# EAGLE design PhoneRobot (EAGLE 6.5.0)
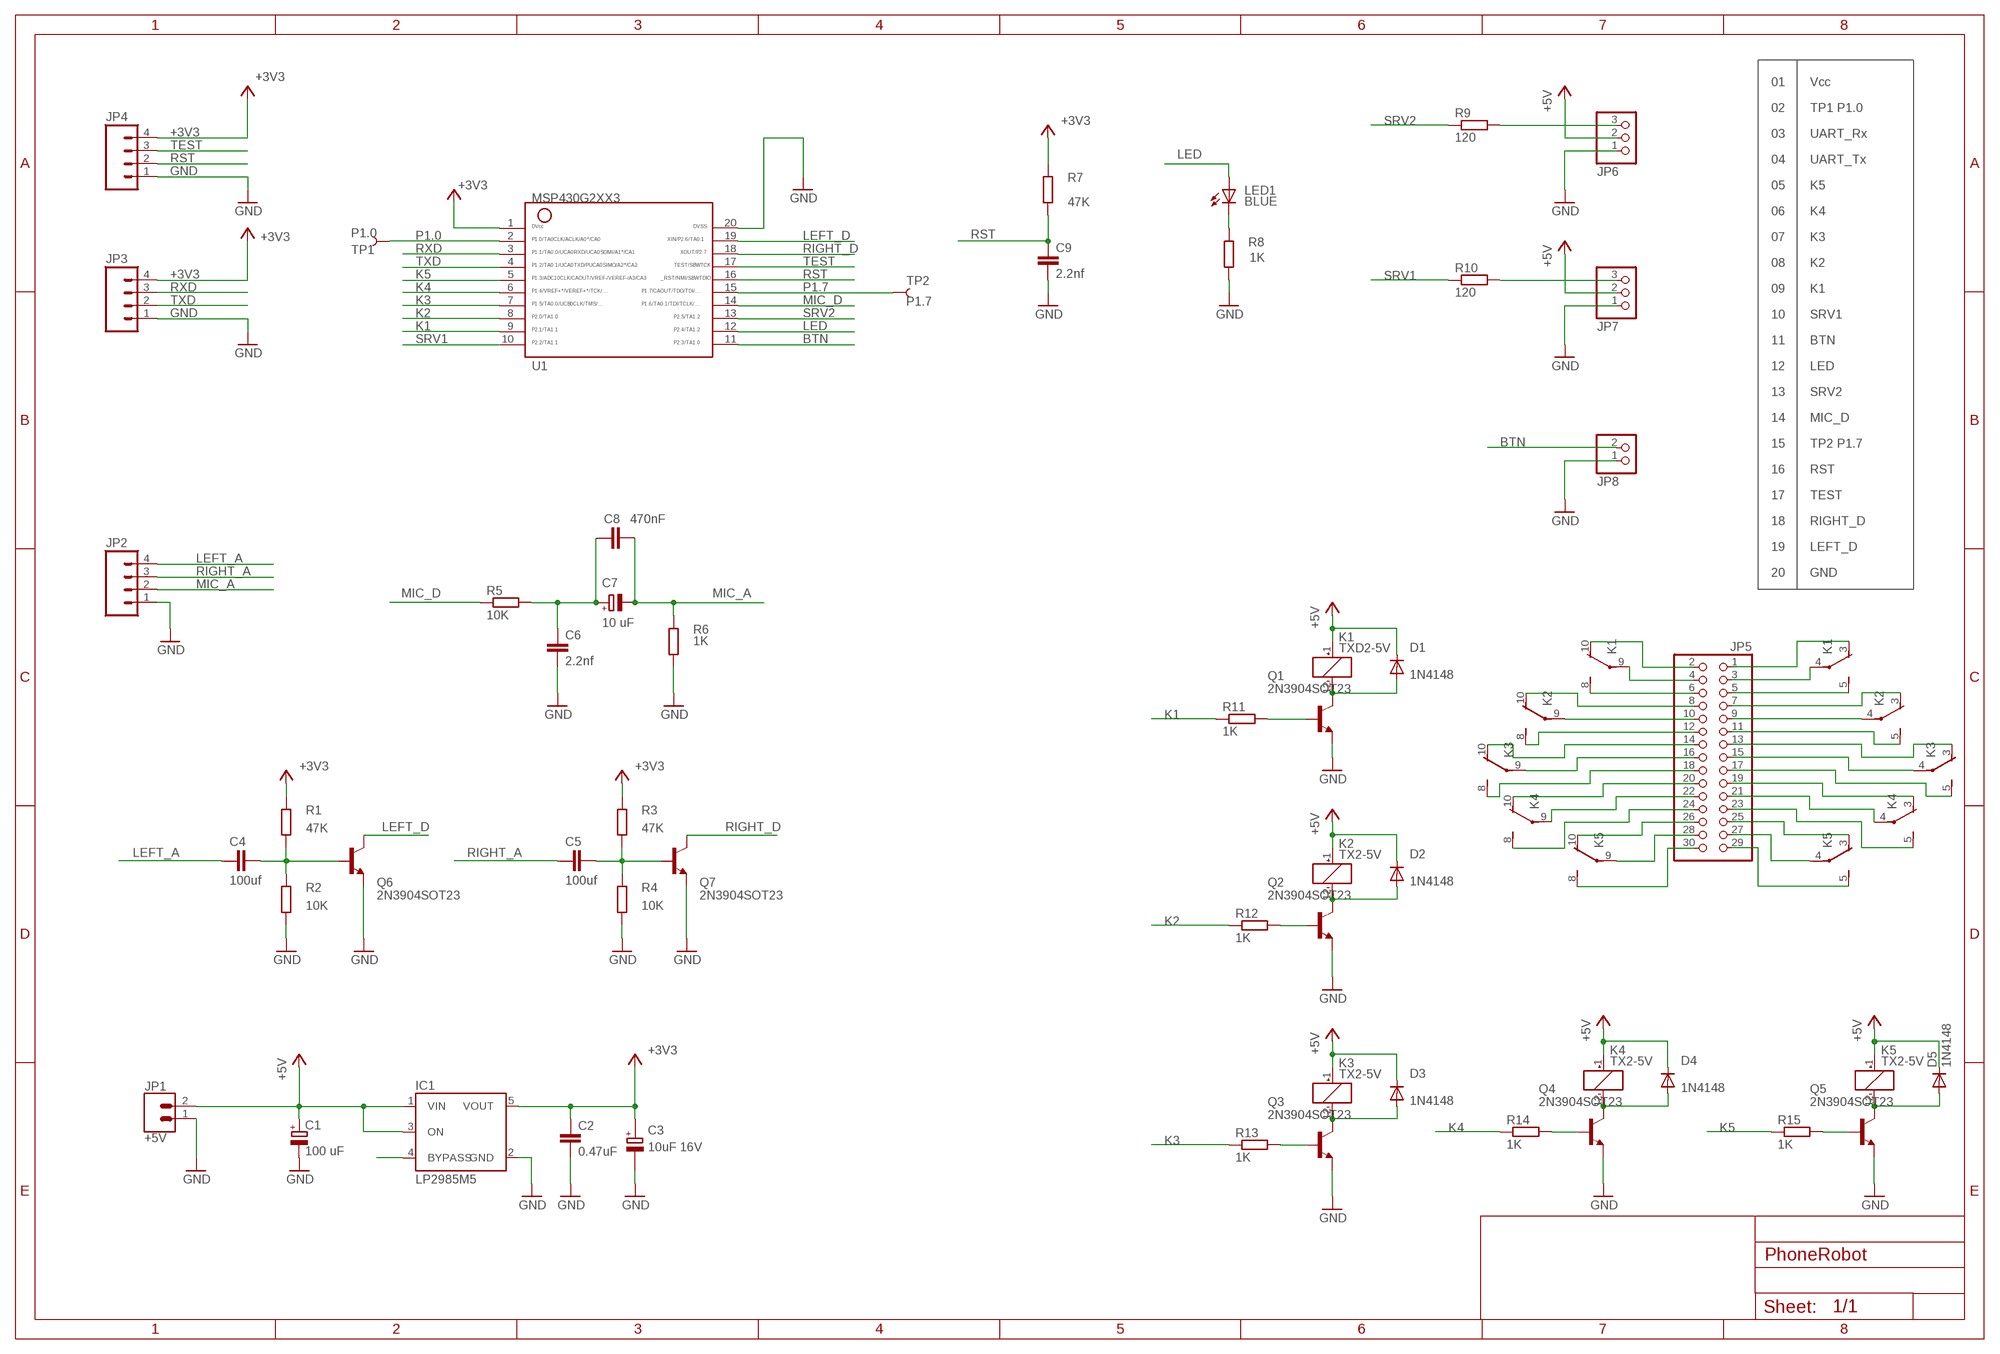
[diagram p0: schematic, sheet 1]

## Parts
C1  100 uF  CPOL-EUE2.5-7  [E2,5-7]
C2  0.47uF  C-EUC0805  [C0805]
C3  10uF 16V  POLARISED_A_CASE  [CAPMP3216X180N]
C4  100uf  C-EUC0805  [C0805]
C5  100uf  C-EUC0805  [C0805]
C6  2.2nf  C-EUC0805  [C0805]
C7  10 uF  CPOL-EUE2.5-7  [E2,5-7]
C8  470nF  C-EUC0805  [C0805]
C9  2.2nf  C-EUC0805  [C0805]
D1  1N4148  DIODE-SOD123  [SOD123]
D2  1N4148  DIODE-SOD123  [SOD123]
D3  1N4148  DIODE-SOD123  [SOD123]
D4  1N4148  DIODE-SOD123  [SOD123]
D5  1N4148  DIODE-SOD123  [SOD123]
IC1  LP2985M5  [SOT23-5]
JP1  +5V  BLUE_TERM  [BLUE_TERM]
JP2  M04PTH  [1X04]
JP3  M04PTH  [1X04]
JP4  M04PTH  [1X04]
JP5  PINHD-2X15  [2X15]
JP6  PINHD-1X3  [1X03]
JP7  PINHD-1X3  [1X03]
JP8  PINHD-1X2  [1X02]
K1  TXD2-5V  [TXD2]
K2  TX2-5V  [TX2]
K3  TX2-5V  [TX2]
K4  TX2-5V  [TX2]
K5  TX2-5V  [TX2]
LED1  BLUE  LEDCHIP-LED0805  [CHIP-LED0805]
Q1  2N3904SOT23  [SOT23-BEC]
Q2  2N3904SOT23  [SOT23-BEC]
Q3  2N3904SOT23  [SOT23-BEC]
Q4  2N3904SOT23  [SOT23-BEC]
Q5  2N3904SOT23  [SOT23-BEC]
Q6  2N3904SOT23  [SOT23-BEC]
Q7  2N3904SOT23  [SOT23-BEC]
R1  47K  R-EU_R0805  [R0805]
R2  10K  R-EU_R0805  [R0805]
R3  47K  R-EU_R0805  [R0805]
R4  10K  R-EU_R0805  [R0805]
R5  10K  R-EU_R0805  [R0805]
R6  1K  R-EU_R0805  [R0805]
R7  47K  R-EU_R0805  [R0805]
R8  1K  R-EU_R0805  [R0805]
R9  120  R-EU_R0805  [R0805]
R10  120  R-EU_R0805  [R0805]
R11  1K  R-EU_R0805  [R0805]
R12  1K  R-EU_R0805  [R0805]
R13  1K  R-EU_R0805  [R0805]
R14  1K  R-EU_R0805  [R0805]
R15  1K  R-EU_R0805  [R0805]
TP1  P1.0  TEST-POINT3  [PAD.03X.03]
TP2  P1.7  TEST-POINT3  [PAD.03X.03]
U1  G2XX3---PW20  [PW20]

## Nets
+3V3 [3V]: C2.1 C3.+ IC1.5(VOUT) JP3.4 JP4.4 R1.2 R3.2 R7.2 U1.1
+5V [5V]: C1.+ D1.C D2.C D3.C D4.C D5.C IC1.1(VIN) IC1.3(ON) JP1.2 JP6.2 JP7.2 K1.1(_:+) K2.1(_:+) K3.1(_:+) K4.1(_:+) K5.1(_:+)
BTN: JP8.2 U1.11
GND [GND]: C1.- C2.2 C3.- C6.2 C9.2 IC1.2(GND) JP1.1 JP2.1 JP3.1 JP4.1 JP6.1 JP7.1 JP8.1 Q1.E Q2.E Q3.E Q4.E Q5.E Q6.E Q7.E R2.1 R4.1 R6.1 R8.1 U1.20
K1: R11.1 U1.9
K2: R12.1 U1.8
K3: R13.1 U1.7
K4: R14.1 U1.6
K5: R15.1 U1.5
LED: LED1.A U1.12
LEFT_A: C4.1 JP2.4
LEFT_D: Q6.C U1.19
MIC_A: C7.- C8.2 JP2.2 R6.2
MIC_D: R5.1 U1.14
N$1: C6.1 C7.+ C8.1 R5.2
N$2: JP5.2 K1.10(O)
N$3: JP5.4 K1.9(P)
N$4: JP5.6 K1.8(S)
N$5: JP5.3 K1.4(P)
N$6: JP6.3 R9.2
N$7: JP5.1 K1.3(O)
N$8: JP5.5 K1.5(S)
N$9: IC1.4(BYPASS)
N$10: D1.A K1.12(_:-) Q1.C
N$11: Q1.B R11.2
N$12: C4.2 Q6.B R1.1 R2.2
N$13: JP5.9 K2.4(1:P)
N$14: JP5.7 K2.3(1:O)
N$15: JP5.11 K2.5(1:S)
N$16: JP5.13 K3.3(1:O)
N$17: JP5.15 K3.4(1:P)
N$18: JP5.17 K3.5(1:S)
N$19: JP5.19 K4.3(1:O)
N$20: JP5.21 K4.4(1:P)
N$21: JP5.23 K4.5(1:S)
N$22: JP5.25 K5.3(1:O)
N$23: LED1.C R8.2
N$24: JP5.27 K5.4(1:P)
N$25: JP5.29 K5.5(1:S)
N$26: JP5.10 K2.9(2:P)
N$27: JP5.8 K2.10(2:O)
N$28: JP5.12 K2.8(2:S)
N$29: JP5.30 K5.8(2:S)
N$30: JP5.28 K5.9(2:P)
N$31: JP5.26 K5.10(2:O)
N$32: JP5.24 K4.8(2:S)
N$33: JP5.22 K4.9(2:P)
N$34: JP5.20 K4.10(2:O)
N$35: JP5.18 K3.8(2:S)
N$36: JP5.16 K3.9(2:P)
N$37: JP5.14 K3.10(2:O)
N$38: D2.A K2.12(_:-) Q2.C
N$39: D3.A K3.12(_:-) Q3.C
N$40: D5.A K5.12(_:-) Q5.C
N$41: D4.A K4.12(_:-) Q4.C
N$42: Q5.B R15.2
N$43: Q4.B R14.2
N$44: Q3.B R13.2
N$45: Q2.B R12.2
N$46: C5.2 Q7.B R3.1 R4.2
N$47: JP7.3 R10.2
P1.0: TP1.P$1 U1.2
P1.7: TP2.P$1 U1.15
RIGHT_A: C5.1 JP2.3
RIGHT_D: Q7.C U1.18
RST: C9.1 JP4.2 R7.1 U1.16
RXD: JP3.3 U1.3
SRV1: R10.1 U1.10
SRV2: R9.1 U1.13
TEST: JP4.3 U1.17
TXD: JP3.2 U1.4

## Notes on the sheet
- 01 | Vcc
- 02 | TP1 P1.0
- 03 | UART_Rx
- 04 | UART_Tx
- 05 | K5
- 06 | K4
- 07 | K3
- 08 | K2
- 09 | K1
- 10 | SRV1
- 11 | BTN
- 12 | LED
- 13 | SRV2
- 14 | MIC_D
- 15 | TP2 P1.7
- 16 | RST
- 17 | TEST
- 18 | RIGHT_D
- 19 | LEFT_D
- 20 | GND

## Library data of the parts
C1 C7 = rcl:CPOL-EU: POLARIZED CAPACITOR, European symbol
C2 C4-C6 C8 C9 = rcl:C-EU: CAPACITOR, European symbol
C3 = ipc-7351-capacitor:POLARISED_
D1-D5 = diode:DIODE-: DIODE
IC1 = v-reg-3:LP2985: National Semiconductor <http://www.national.com> Micropower Linear Regulator 150mA regulated output, Vin 16V max., ultra-low dropout of 300mV @ 150mA, 1µA standby current, low noise
JP1 = jlab:BLUE_TERM
JP2-JP4 = SparkFun:M04: Header 4 Standard 4-pin 0.1" header. Use with straight break away headers (SKU : PRT-00116), right angle break away headers (PRT-00553), swiss pins (PRT-00743), machine pins (PRT-00117), and female headers (PRT-00115). Molex polarized connector foot print use with SKU : PRT-08231 with associated crimp pins and housings. 1MM SMD Version SKU: PRT-10208
JP5 = pinhead:PINHD-2X15: PIN HEADER
JP6 JP7 = pinhead:PINHD-1X3: PIN HEADER
JP8 = pinhead:PINHD-1X2: PIN HEADER
K1 = relay:TX?-*: TX Relais NAiS TX-D RELAYS HIGH INSULATION Conforming to the supplementary insulation class of EN Standards (EN41003) Source: http://www.mew-europe.com/.. en_ds_61022_0007.pdf TX-S RELAYS SMALL POLARIZED RELAY WITH HIGH SENSITIVITY 50mW Source: http://www.mew-europe.com/.. en_ds_61022_0022.pdf; MPN: TXD2-5V; OC_FARNELL: unknown; OC_NEWARK: 13P9525
K2-K5 = relay:TX2?-*: 2 AMP. HIGH CAPACITY RELAY NAiS WITH HIGH SURGE VOLTAGE & HIGH BREAKDOWN VOLTAGE Source: http://www.mew-europe.com/.. en_ds_61022_0001.pdf; MF: AROMAT/ MATSUSHITA; MPN: TX2-5V; OC_FARNELL: 1200950; OC_NEWARK: 67K1296
LED1 = jlab:LED: LED OSRAM: - CHIPLED LG R971, LG N971, LY N971, LG Q971, LY Q971, LO R971, LY R971 LH N974, LH R974 LS Q976, LO Q976, LY Q976 LO Q996 - Hyper CHIPLED LW Q18S LB Q993, LB Q99A, LB R99A - SideLED LS A670, LO A670, LY A670, LG A670, LP A670 LB A673, LV A673, LT A673, LW A673 LH A674 LY A675 LS A676, LA A676, LO A676, LY A676, LW A676 LS A679, LY A679, LG A679 - Hyper Micro SIDELED® LS Y876, LA Y876, LO Y876, LY Y876 LT Y87S - SmartLED LW L88C, LW L88S LB L89C, LB L89S, LG L890 LS L89K, LO L89K, LY L89K LS L896, LA L896, LO L896, LY L896 - TOPLED LS T670, LO T670, LY T670, LG T670, LP T670 LSG T670, LSP T670, LSY T670, LOP T670, LYG T670 LG T671, LOG T671, LSG T671 LB T673, LV T673, LT T673, LW T673 LH T674 LS T676, LA T676, LO T676, LY T676, LB T676, LH T676, LSB T676, LW T676 LB T67C, LV T67C, LT T67C, LS T67K, LO T67K, LY T67K, LW E67C LS E67B, LA E67B, LO E67B, LY E67B, LB E67C, LV E67C, LT E67C LW T67C LS T679, LY T679, LG T679 LS T770, LO T770, LY T770, LG T770, LP T770 LB T773, LV T773, LT T773, LW T773 LH T774 LS E675, LA E675, LY E675, LS T675 LS T776, LA T776, LO T776, LY T776, LB T776 LHGB T686 LT T68C, LB T68C - Hyper Mini TOPLED® LB M676 - Mini TOPLED Santana® LG M470 LS M47K, LO M47K, LY M47K Source: http://www.osram.convergy.de LUXEON: - LUMILED® LXK2-PW12-R00, LXK2-PW12-S00, LXK2-PW14-U00, LXK2-PW14-V00 LXK2-PM12-R00, LXK2-PM12-S00, LXK2-PM14-U00 LXK2-PE12-Q00, LXK2-PE12-R00, LXK2-PE12-S00, LXK2-PE14-T00, LXK2-PE14-U00 LXK2-PB12-K00, LXK2-PB12-L00, LXK2-PB12-M00, LXK2-PB14-N00, LXK2-PB14-P00, LXK2-PB14-Q00 LXK2-PR12-L00, LXK2-PR12-M00, LXK2-PR14-Q00, LXK2-PR14-R00 LXK2-PD12-Q00, LXK2-PD12-R00, LXK2-PD12-S00 LXK2-PH12-R00, LXK2-PH12-S00 LXK2-PL12-P00, LXK2-PL12-Q00, LXK2-PL12-R00 Source: www.luxeon.com KINGBRIGHT: KA-3528ASYC Source: www.kingbright.com
Q1-Q7 = transistor-npn:2N3904: NPN Transistor
R1-R15 = rcl:R-EU_: RESISTOR, European symbol
TP1 TP2 = SparkFun-Passives:TEST-POINT: Bare copper test points for troubleshooting or ICT
U1 = TI_MSP430_v16:G2XX3---PW20: MSP430G2XX1 TSSOP (PW) 20 Pin Package

## Net classes
1 5V: width 0.305 mm, drill 0.305 mm, clearance 0.305 mm
2 3V: width 0.305 mm, drill 0.305 mm, clearance 0.305 mm
3 GND: width 0.305 mm, clearance 0.305 mm

## Board
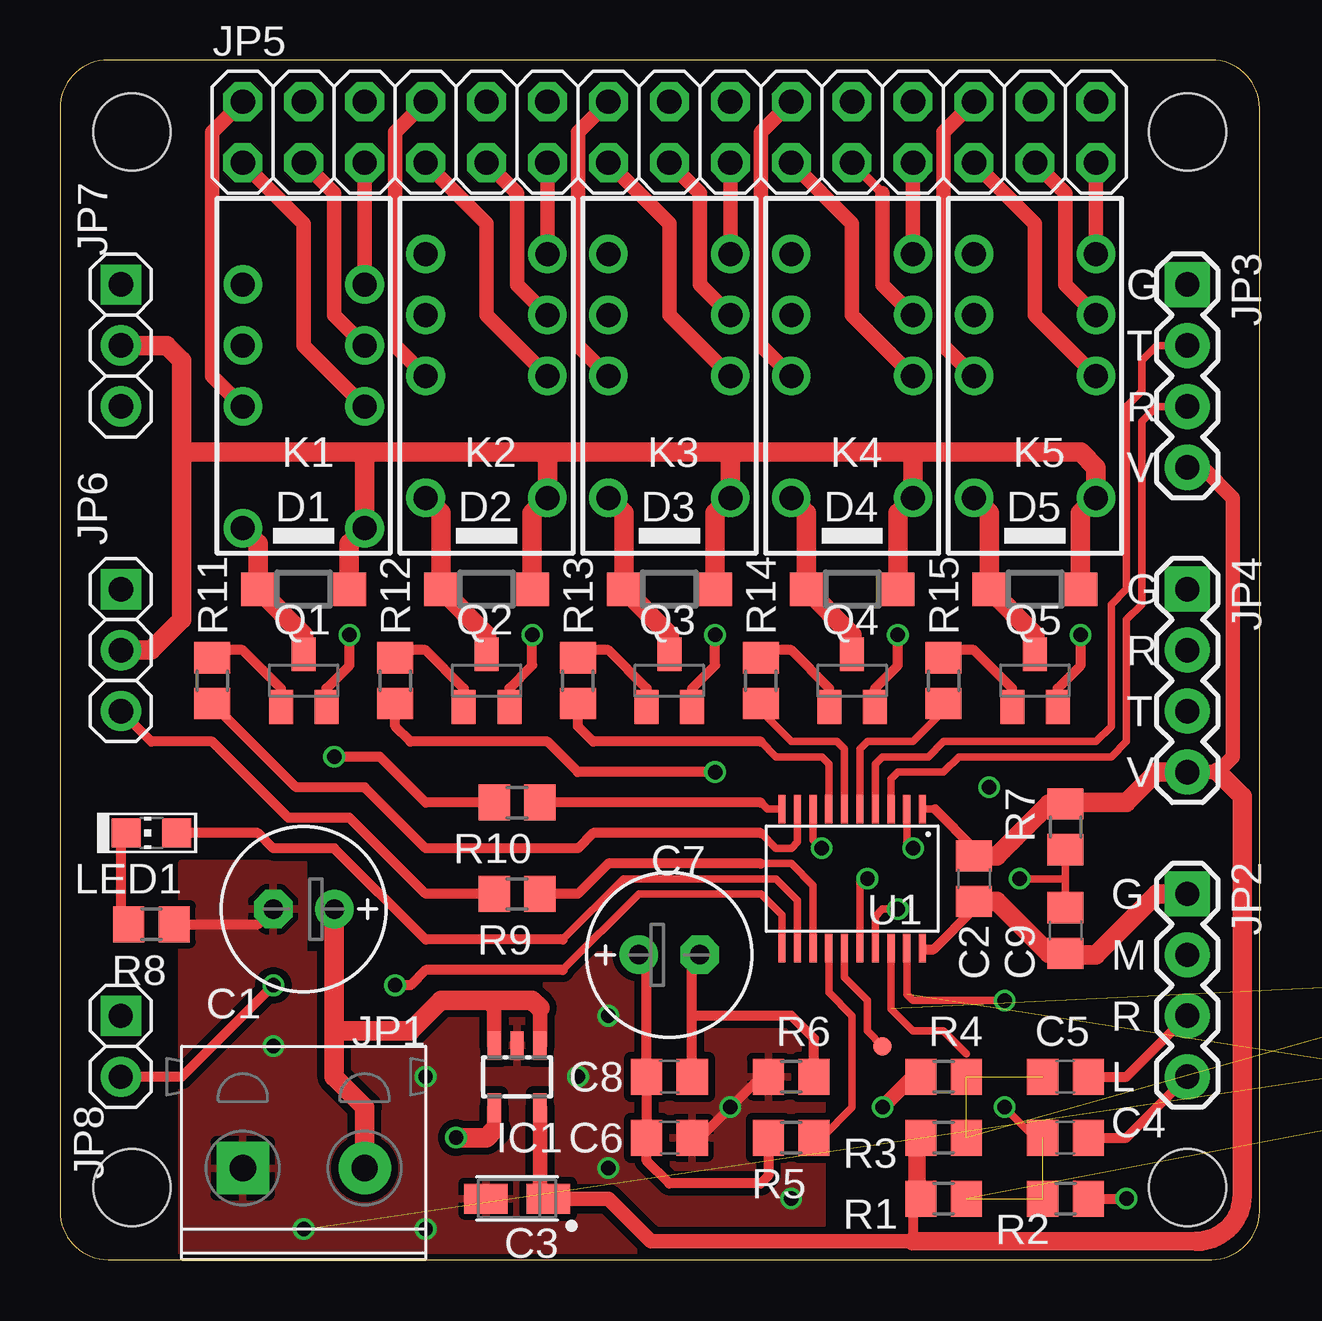
[diagram p1: board, top side]
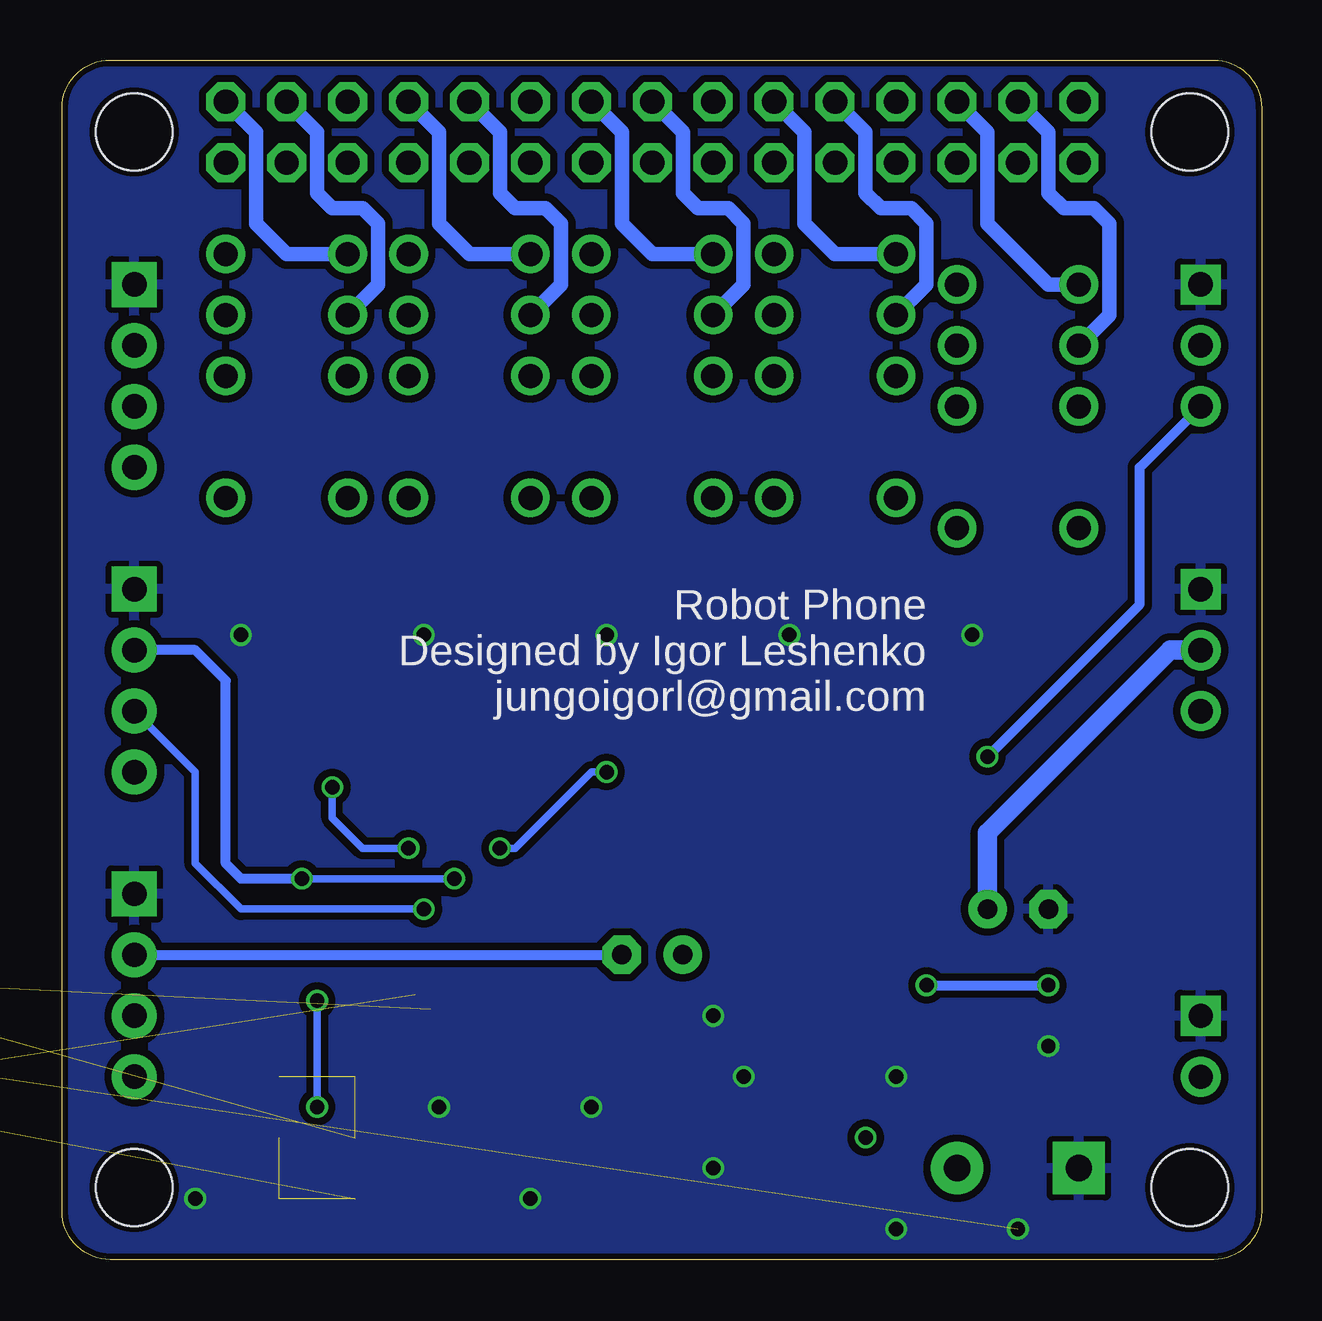
[diagram p2: board, bottom side, seen from below]

Size 50 x 50 mm. Coordinates in mm from the lower left corner, seen from the top.
Outline: 0,48 0,2 arc90 2,0 48,0 arc90 50,2 50,48 arc90 48,50 2,50 arc90 0,48
Copper layers (1*16): Top 0.035mm / dielectric 1.5mm / Bottom 0.035mm
Design rules "PhoneRobot": minimum track width 6mil, minimum drill 0.6mm, track to track 6mil, track to pad 6mil, pad to pad 6mil, via to via 6mil, smd to smd 0mil, copper to edge 10mil, drill to drill 10mil, minimum pad ring 12mil, minimum via ring 6mil, stop-mask expansion 2mil, vias tented up to drill 40mil, thermal gap 10mil
Holes 3.2 mm at 3,47 3,3 47,47 47,3

### Footprints (pad centres in the part's own frame; a part is rotated, then mirrored left to right if it is on the bottom)
E2,5-7 = drill 0.813 pad 1.6: + -1.27,0 | drill 0.813 pad 1.6 octagon: - 1.27,0
C0805 = smd 1.3 x 1.5: 1 -0.95,0; 2 0.95,0
CAPMP3216X180N = smd 1.8 x 1.25: + -1.3,0; - 1.3,0
SOD123 = smd 1.4 x 1.4: A 1.9,0; C -1.9,0
SOT23-5 = smd 0.55 x 1.2: 1 -0.95,-1.3; 2 0,-1.3; 3 0.95,-1.3; 4 0.95,1.3; 5 -0.95,1.3
BLUE_TERM = drill 1.1 pad 2.184 square: 1 0,2.54 | drill 1.1 pad 2.184: 2 0,-2.54
1X04 = drill 1.016 pad 1.88 square: 1 0,0 | drill 1.016 pad 1.88: 2 2.54,0; 3 5.08,0; 4 7.62,0
2X15 = drill 1.016 octagon: 1 -17.78,-1.27; 2 -17.78,1.27; 3 -15.24,-1.27; 4 -15.24,1.27; 5 -12.7,-1.27; 6 -12.7,1.27; 7 -10.16,-1.27; 8 -10.16,1.27; 9 -7.62,-1.27; 10 -7.62,1.27; 11 -5.08,-1.27; 12 -5.08,1.27; 13 -2.54,-1.27; 14 -2.54,1.27; 15 0,-1.27; 16 0,1.27; 17 2.54,-1.27; 18 2.54,1.27; 19 5.08,-1.27; 20 5.08,1.27; 21 7.62,-1.27; 22 7.62,1.27; 23 10.16,-1.27; 24 10.16,1.27; 25 12.7,-1.27; 26 12.7,1.27; 27 15.24,-1.27; 28 15.24,1.27; 29 17.78,-1.27; 30 17.78,1.27
1X03 = drill 1.016 pad 1.676 square: 1 -2.54,0 | drill 1.016 pad 1.676: 2 0,0; 3 2.54,0
1X02 = drill 1 pad 1.676 square: 1 -1.27,0 | drill 1 pad 1.676: 2 1.27,0
TXD2 = drill 1: 1 -6.35,-2.54; 3 -1.27,-2.54; 4 1.27,-2.54; 5 3.81,-2.54; 8 3.81,2.54; 9 1.27,2.54; 10 -1.27,2.54; 12 -6.35,2.54
TX2 = drill 1: 1 -5.08,-2.54; 3 0,-2.54; 4 2.54,-2.54; 5 5.08,-2.54; 8 5.08,2.54; 9 2.54,2.54; 10 0,2.54; 12 -5.08,2.54
CHIP-LED0805 = smd 1.2 x 1.2: A 0,-1.05; C 0,1.05
SOT23-BEC = smd 1 x 1.4: B -0.95,-1.1; C 0,1.1; E 0.95,-1.1
R0805 = smd 1.3 x 1.5: 1 -0.95,0; 2 0.95,0
PAD.03X.03 = smd 0.762 x 0.762: P$1 0,0
PW20 = smd 0.3 x 1.2: 1 -2.925,-2.9; 2 -2.275,-2.9; 3 -1.625,-2.9; 4 -0.975,-2.9; 5 -0.325,-2.9; 6 0.325,-2.9; 7 0.975,-2.9; 8 1.625,-2.9; 9 2.275,-2.9; 10 2.925,-2.9; 11 2.925,2.9; 12 2.275,2.9; 13 1.625,2.9; 14 0.975,2.9; 15 0.325,2.9; 16 -0.325,2.9; 17 -0.975,2.9; 18 -1.625,2.9; 19 -2.275,2.9; 20 -2.925,2.9

### Placement (x,y rotation side)
C1  10.16,14.61 180 top
C2  38.1,15.88 270 top
C3  19.05,2.54 180 top
C4  41.91,5.08 180 top
C5  41.91,7.62 180 top
C6  25.4,5.08 0 top
C7  25.4,12.7 0 top
C8  25.4,7.62 0 top
C9  41.91,13.72 270 top
D1  10.16,27.94 180 top
D2  17.78,27.94 180 top
D3  25.4,27.94 180 top
D4  33.02,27.94 180 top
D5  40.64,27.94 180 top
IC1  19.05,7.62 180 top
JP1  10.16,3.81 90 top
JP2  46.99,15.24 270 top
JP3  46.99,40.64 270 top
JP4  46.99,27.94 270 top
JP5  25.4,46.99 0 top
JP6  2.54,25.4 270 top
JP7  2.54,38.1 270 top
JP8  2.54,8.89 270 top
K1  10.16,36.83 90 top
K2  17.78,36.83 90 top
K3  25.4,36.83 90 top
K4  33.02,36.83 90 top
K5  40.64,36.83 90 top
LED1  3.81,17.78 90 top
Q1  10.16,24.13 0 top
Q2  17.78,24.13 0 top
Q3  25.4,24.13 0 top
Q4  33.02,24.13 0 top
Q5  40.64,24.13 0 top
Q6  58.42,7.62 90 top  (outside the outline)
Q7  55.88,11.43 90 top  (outside the outline)
R1  36.83,2.54 180 top
R2  41.91,2.54 180 top
R3  36.83,5.08 180 top
R4  36.83,7.62 0 top
R5  30.48,5.08 180 top
R6  30.48,7.62 0 top
R7  41.91,18.03 90 top
R8  3.81,13.97 180 top
R9  19.05,15.24 180 top
R10  19.05,19.05 180 top
R11  6.35,24.13 90 top
R12  13.97,24.13 90 top
R13  21.59,24.13 90 top
R14  29.21,24.13 90 top
R15  36.83,24.13 90 top
TP1  38.73,19.68 0 top
TP2  34.29,8.89 0 top
U1  33.02,15.88 180 top

### Tracks (layer width: path | path; a pad name or v marks a point on that pad's centre or on a via)
+3V3
  Top 0.305: U1.1 36.47,18.77
  Top 0.406: R1.2 R3.2 35.56,4.76 35.56,0.76 | 36.47,18.77 38.1,17.14 C2.1 | 41.21,18.98 R7.2 41.98,19.05
  Top 0.61: JP4.4 48.26,20.32 48.9,20.95 48.9,31.75 47.62,33.02 JP3.4 | 35.56,0.76 24.64,0.76 22.86,2.54 C3.+ 20,2.89 IC1.5
  Top 0.762: 35.56,0.76 47.37,0.76
  Top 0.813: 41.21,18.98 39.05,16.82 C2.1 | 41.98,19.05 44.45,19.05 45.72,20.32 JP4.4 | 47.37,0.76 arc90 49.28,2.67 49.28,19.3 48.26,20.32
+5V
  Top 0.61: IC1.1 20,10.48 | IC1.3 18.1,10.47 17.78,10.79
  Top 0.813: 20.32,33.66 27.94,33.66 | 27.94,33.66 35.56,33.66 | 35.56,33.66 42.55,33.66 43.18,33.02 K5.1 42.54,31.11 D5.C | 20.32,33.66 K2.1 19.68,31.11 D2.C | 27.94,33.66 K3.1 27.3,31.11 D3.C | 35.56,33.66 K4.1 34.92,31.11 D4.C | D1.C 12.06,29.84 K1.1 12.7,33.66 | JP7.2 4.45,38.1 5.08,37.47 5.08,33.66 | 5.08,33.66 12.7,33.66 | 12.7,33.66 20.32,33.66 | JP1.2 12.7,6.35 11.43,7.62 11.43,9.53 | 11.43,9.53 C1.+ | JP6.2 3.81,25.4 5.08,26.67 5.08,33.66 | 20,10.48 19.68,10.79 17.78,10.79 15.88,10.79 14.61,9.53 11.43,9.53
  Bottom 0.813: C1.+ 11.43,17.78 3.81,25.4 JP6.2
BTN  (via drill 0.6)
  Top 0.305: U1.11 30.09,14.36 29.21,15.24 24.13,15.24 20.95,12.06
  Top 0.406: v8.89,11.43 5.08,7.62 JP8.2 | 20.95,12.06 15.24,12.06 14.61,11.43 v13.97,11.43
  Bottom 0.406: v13.97,11.43 v8.89,11.43
GND  (via drill 0.6)  (2 unrouted)
  Top 0.305: 29.21,7.62 R6.1 | 26.67,5.08 C6.2 | U1.20 36.47,12.97 36.42,12.93
  Top 0.406: Q4.E 33.97,23.81 34.92,24.77 v34.92,26.04 | Q5.E 41.59,23.81 42.55,24.77 v42.55,26.04 | Q1.E 11.11,23.81 12.06,24.77 v12.06,26.04 | Q2.E 18.73,23.81 19.68,24.77 v19.68,26.04 | Q3.E 26.35,23.81 27.3,24.77 v27.3,26.04 | R8.1 8.26,13.97 C1.- | 36.47,12.97 38.1,14.61 C2.2 | C9.2 41.98,12.7 | R2.1 v44.45,2.54 | 29.21,7.62 v27.94,6.35 26.67,5.08 | 36.07,12.93 36.42,12.93
  Top 0.61: v34.29,6.35 35.56,7.62 R4.1
  Top 0.813: C9.2 41.21,12.77 39.05,14.93 C2.2 | 41.98,12.7 43.18,12.7 45.72,15.24 JP2.1
  other vias: 8.89,8.89 10.16,1.27 15.24,1.27 15.24,7.62 22.86,10.16 21.59,7.62 22.86,3.81 30.48,2.54
  pour Bottom: 0,50 50,50 50,0 0,0
  pour Top: 5.08,0 31.75,0 31.75,12.7 10.16,12.7 10.16,16.51 5.08,16.51
K1
  Top 0.305: 29.21,17.78 29.84,17.14 30.48,17.14 30.75,17.41 U1.9
  Top 0.406: R11.1 9.85,19.68 12.7,19.68 15.24,17.14 21.59,17.14 22.23,17.78 29.21,17.78
K2  (via drill 0.6)
  Top 0.305: U1.8 31.39,17.5 v31.75,17.14
  Top 0.406: v27.3,20.32 21.59,20.32 20.32,21.59 14.61,21.59 13.97,22.23 R12.1
  Bottom 0.305: v31.75,17.14 31.11,17.14 27.94,20.32 v27.3,20.32
K3
  Top 0.305: 29.21,21.59 29.84,20.95 31.75,20.95 32.05,20.66 U1.7
  Top 0.406: 29.21,21.59 22.23,21.59 21.59,22.23 R13.1
K4
  Top 0.305: R14.1 29.21,22.86 30.48,21.59 32.38,21.59 32.7,21.28 U1.6
K5
  Top 0.305: U1.5 33.34,21.28 33.66,21.59 35.56,21.59 36.83,22.86 R15.1
LED
  Top 0.305: U1.12 30.75,14.97 29.84,15.88 23.5,15.88 20.95,13.34
  Top 0.406: LED1.A 8.26,17.78 8.89,17.14 11.43,17.14 15.24,13.34 20.95,13.34
LEFT_A
  Top 0.406: C4.1 44.45,5.08 JP2.4
LEFT_D  (via drill 0.6)  (1 unrouted)
  Top 0.305: U1.19 35.3,11.06 35.56,10.79 v39.37,10.79 | v39.37,6.35 40.64,5.08
  Bottom 0.305: v39.37,10.79 v39.37,6.35
MIC_A
  Top 0.406: C8.2 26.35,10.16 | 26.35,10.16 26.35,12.38 C7.- | R6.2 31.43,9.21 30.48,10.16 26.35,10.16
  Bottom 0.406: JP2.2 C7.-
MIC_D
  Top 0.305: U1.14 32.05,11.13 33.02,10.16 33.02,6.35 31.75,5.08 R5.1
N$1
  Top 0.406: C7.+ 24.45,12.38 C8.1 C6.1 24.45,4.12 25.4,3.17 29.21,3.17 29.53,3.5 R5.2
N$2
  Top 0.61: JP5.2 6.35,46.99 6.35,36.83 K1.10
N$3
  Bottom 0.61: JP5.4 8.89,46.99 8.89,44.45 8.26,43.81 6.99,43.81 6.35,43.18 6.35,39.37 K1.9
N$4
  Bottom 0.61: JP5.6 11.43,46.99 11.43,43.18 8.89,40.64 K1.8
N$5
  Top 0.61: JP5.3 11.43,44.45 11.43,39.37 K1.4
N$6
  Top 0.406: JP6.3 3.81,21.59 6.35,21.59 9.53,18.41 12.06,18.41 15.24,15.24 R9.2
N$7
  Top 0.61: JP5.1 10.16,43.18 10.16,38.1 K1.3
N$8
  Top 0.61: JP5.5 K1.5
N$9  (via drill 0.6)
  Top 0.61: IC1.4 18.1,5.4
  Top 0.813: 18.1,5.4 17.78,5.08 v16.51,5.08
N$10
  Top 0.813: Q1.C 10.16,26.04 D1.A 8.26,29.84 K1.12
N$11
  Top 0.406: Q1.B 9.21,23.81 7.62,25.4 6.67,25.4 R11.2
N$12  (3 unrouted)
N$13
  Top 0.61: K2.4 19.05,40.64 19.05,44.45 JP5.9
N$14
  Top 0.61: JP5.7 17.78,43.18 17.78,39.37 K2.3
N$15
  Top 0.61: K2.5 JP5.11
N$16
  Top 0.61: K3.3 25.4,39.37 25.4,43.18 JP5.13
N$17
  Top 0.61: K3.4 26.67,40.64 26.67,44.45 JP5.15
N$18
  Top 0.61: K3.5 JP5.17
N$19
  Top 0.61: K4.3 33.02,39.37 33.02,43.18 JP5.19
N$20
  Top 0.406: 34.29,44.45 JP5.21
  Top 0.61: K4.4 34.29,40.64 34.29,44.45
N$21
  Top 0.61: K4.5 JP5.23
N$22
  Top 0.61: K5.3 40.64,39.37 40.64,43.18 JP5.25
N$23
  Top 0.406: LED1.C 2.54,17.78 2.54,14.29 R8.2
N$24
  Top 0.61: K5.4 41.91,40.64 41.91,44.45 JP5.27
N$25
  Top 0.61: K5.5 JP5.29
N$26
  Bottom 0.61: K2.9 13.97,40.64 13.97,43.18 14.61,43.81 15.88,43.81 16.51,44.45 16.51,46.99 JP5.10
N$27
  Top 0.61: K2.10 13.97,38.1 13.97,46.99 JP5.8
N$28
  Bottom 0.61: K2.8 17.78,41.91 19.05,43.18 19.05,46.99 JP5.12
N$29
  Bottom 0.61: K5.8 40.64,41.91 41.91,43.18 41.91,46.99 JP5.30
N$30
  Bottom 0.61: K5.9 36.83,40.64 36.83,43.18 37.47,43.81 38.73,43.81 39.37,44.45 39.37,46.99 JP5.28
N$31
  Top 0.61: K5.10 36.83,38.1 36.83,46.99 JP5.26
N$32
  Bottom 0.61: K4.8 33.02,41.91 34.29,43.18 34.29,46.99 JP5.24
N$33
  Bottom 0.61: K4.9 29.21,40.64 29.21,43.18 29.84,43.81 31.11,43.81 31.75,44.45 31.75,46.99 JP5.22
N$34
  Top 0.61: K4.10 29.21,38.1 29.21,46.99 JP5.20
N$35
  Bottom 0.61: K3.8 25.4,41.91 26.67,43.18 26.67,46.99 JP5.18
N$36
  Bottom 0.61: K3.9 21.59,40.64 21.59,43.18 22.23,43.81 23.5,43.81 24.13,44.45 24.13,46.99 JP5.16
N$37
  Top 0.61: K3.10 21.59,38.1 21.59,46.99 JP5.14
N$38
  Top 0.813: K2.12 15.88,31.11 D2.A 17.78,26.04 Q2.C
N$39
  Top 0.813: K3.12 23.5,31.11 D3.A 25.4,26.04 Q3.C
N$40
  Top 0.813: K5.12 38.74,31.11 D5.A 40.64,26.04 Q5.C
N$41
  Top 0.813: K4.12 31.12,31.11 D4.A 33.02,26.04 Q4.C
N$42
  Top 0.406: Q5.B 39.69,23.81 38.1,25.4 37.15,25.4 R15.2
N$43
  Top 0.406: Q4.B 32.07,23.81 30.48,25.4 29.53,25.4 R14.2
N$44
  Top 0.406: Q3.B 24.45,23.81 22.86,25.4 21.91,25.4 R13.2
N$45
  Top 0.406: Q2.B 16.83,23.81 15.24,25.4 14.29,25.4 R12.2
N$46  (3 unrouted)
N$47  (via drill 0.6)
  Top 0.406: R10.2 15.24,19.05 13.34,20.95 v11.43,20.95
  Bottom 0.406: v11.43,20.95 5.08,27.3 5.08,33.02 JP7.3
P1.0  (via drill 0.6)
  Top 0.305: U1.2 35.3,17.41 v35.56,17.14
  Bottom 0.305: v35.56,17.14 37.47,17.14 38.73,18.41 TP1.P$1
  other vias: 38.73,19.68
P1.7
  Top 0.305: U1.15 32.7,11.76 33.66,10.79 33.66,9.53 TP2.P$1
RIGHT_A
  Top 0.406: C5.1 44.45,7.62 JP2.3
RIGHT_D  (1 unrouted)
  Top 0.305: U1.18 34.65,10.44 35.56,9.53 36.83,9.53 37.78,8.57
RST  (via drill 0.6)
  Top 0.305: C9.1 41.91,15.88 | 41.91,15.88 R7.1 | U1.16 33.34,15.88 v33.66,15.88 | v40.01,15.88 41.91,15.88
  Bottom 0.305: v33.66,15.88 v40.01,15.88
  Bottom 0.406: v40.01,15.88 42.55,15.88 43.18,16.51 43.18,24.13 44.45,25.4 JP4.2
RXD
  Top 0.305: JP3.3 45.72,35.56 45.09,34.92 45.09,27.3 44.45,26.67 44.45,21.59 43.81,20.95 37.47,20.95 36.83,20.32 34.92,20.32 34.65,20.04 U1.3
SRV1
  Top 0.305: U1.10 29.48,18.77 29.21,19.05
  Top 0.406: 29.21,19.05 R10.1
SRV2
  Top 0.305: U1.13 31.39,15.6 30.48,16.51 29.21,16.51
  Top 0.406: 29.21,16.51 22.86,16.51 21.59,15.24 R9.1
TEST  (via drill 0.6)
  Top 0.305: U1.17 33.99,14.31 34.29,14.61 v34.92,14.61
  Bottom 0.305: v34.92,14.61 42.55,14.61 44.45,16.51 44.45,20.32 JP4.3
TXD
  Top 0.305: JP3.2 45.72,38.1 45.09,37.47 45.09,36.2 44.45,35.56 44.45,27.94 43.81,27.3 43.81,22.23 43.18,21.59 36.83,21.59 36.2,20.95 34.29,20.95 33.99,20.66 U1.4

### Text on the board
tNames: G | T | R | V | G | R | T | V | G | M | R | L
bNames: Robot Phone / Designed by Igor Leshenko / jungoigorl@gmail.com